# EAGLE schematic Controller Board (EAGLE 8.2.1)
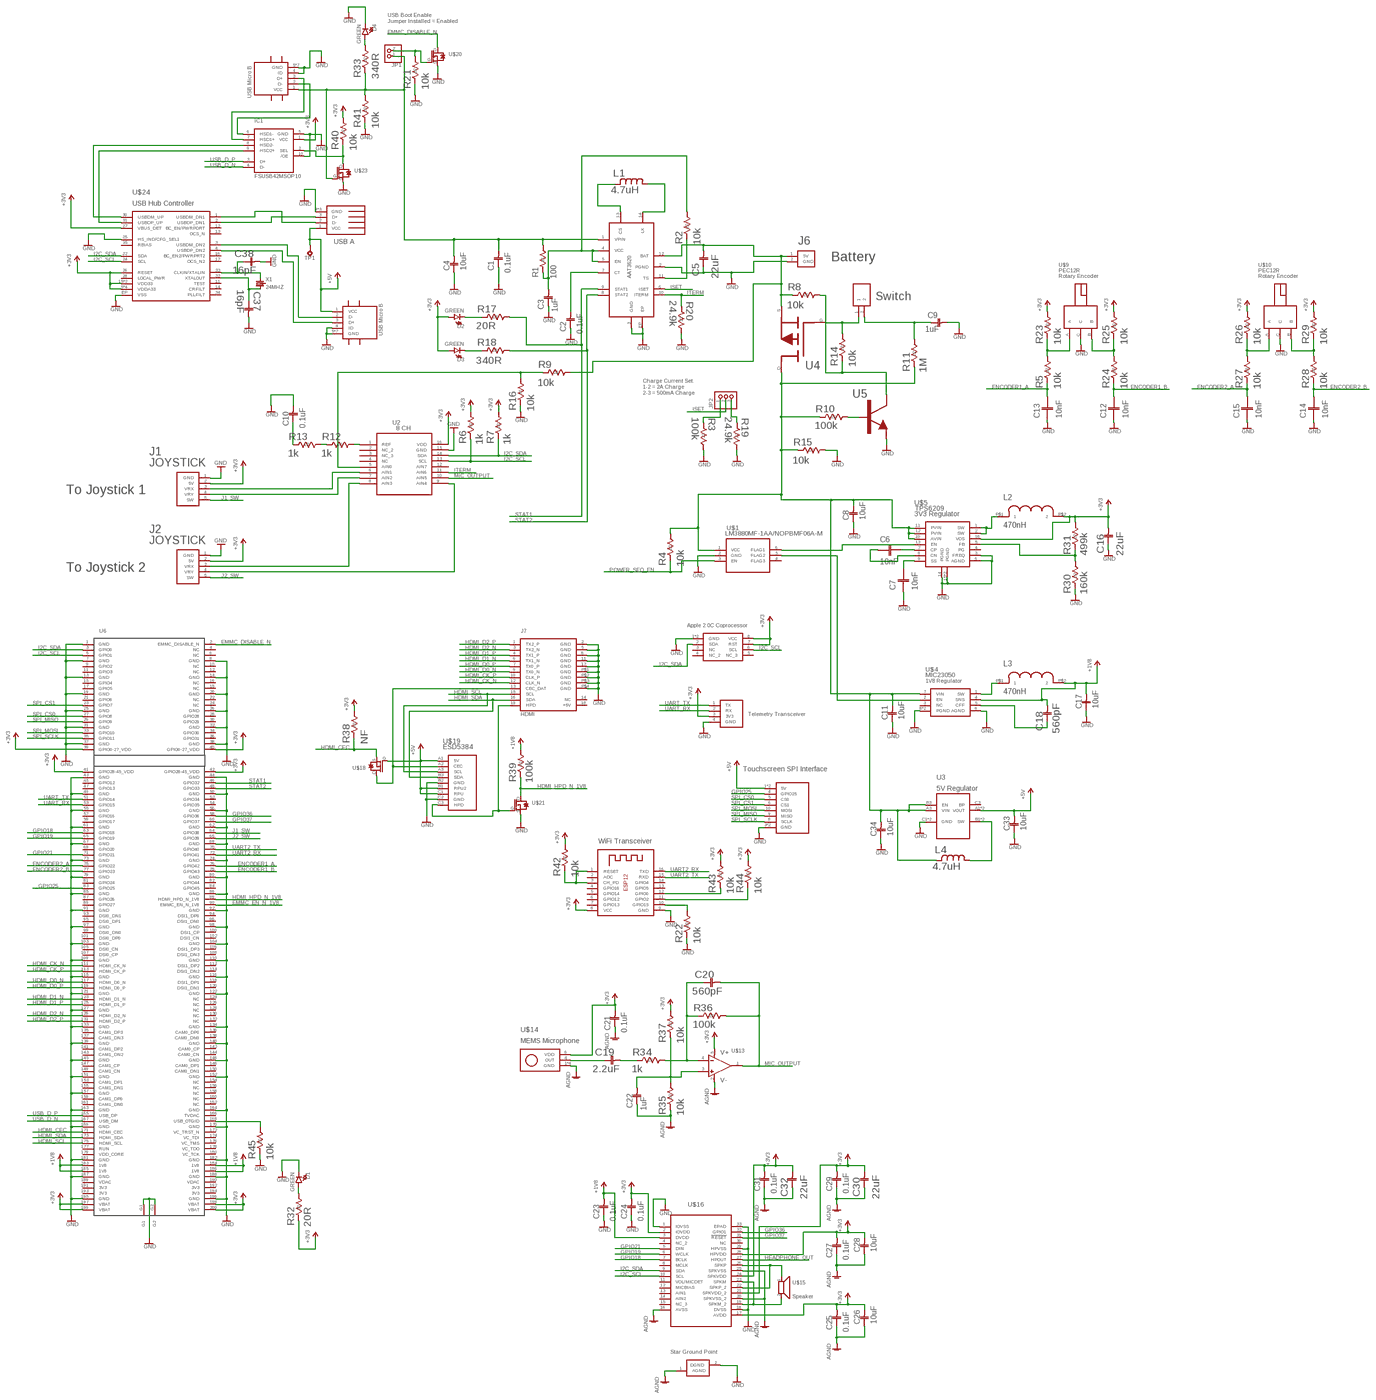
[diagram p0: schematic, sheet 1, overview]
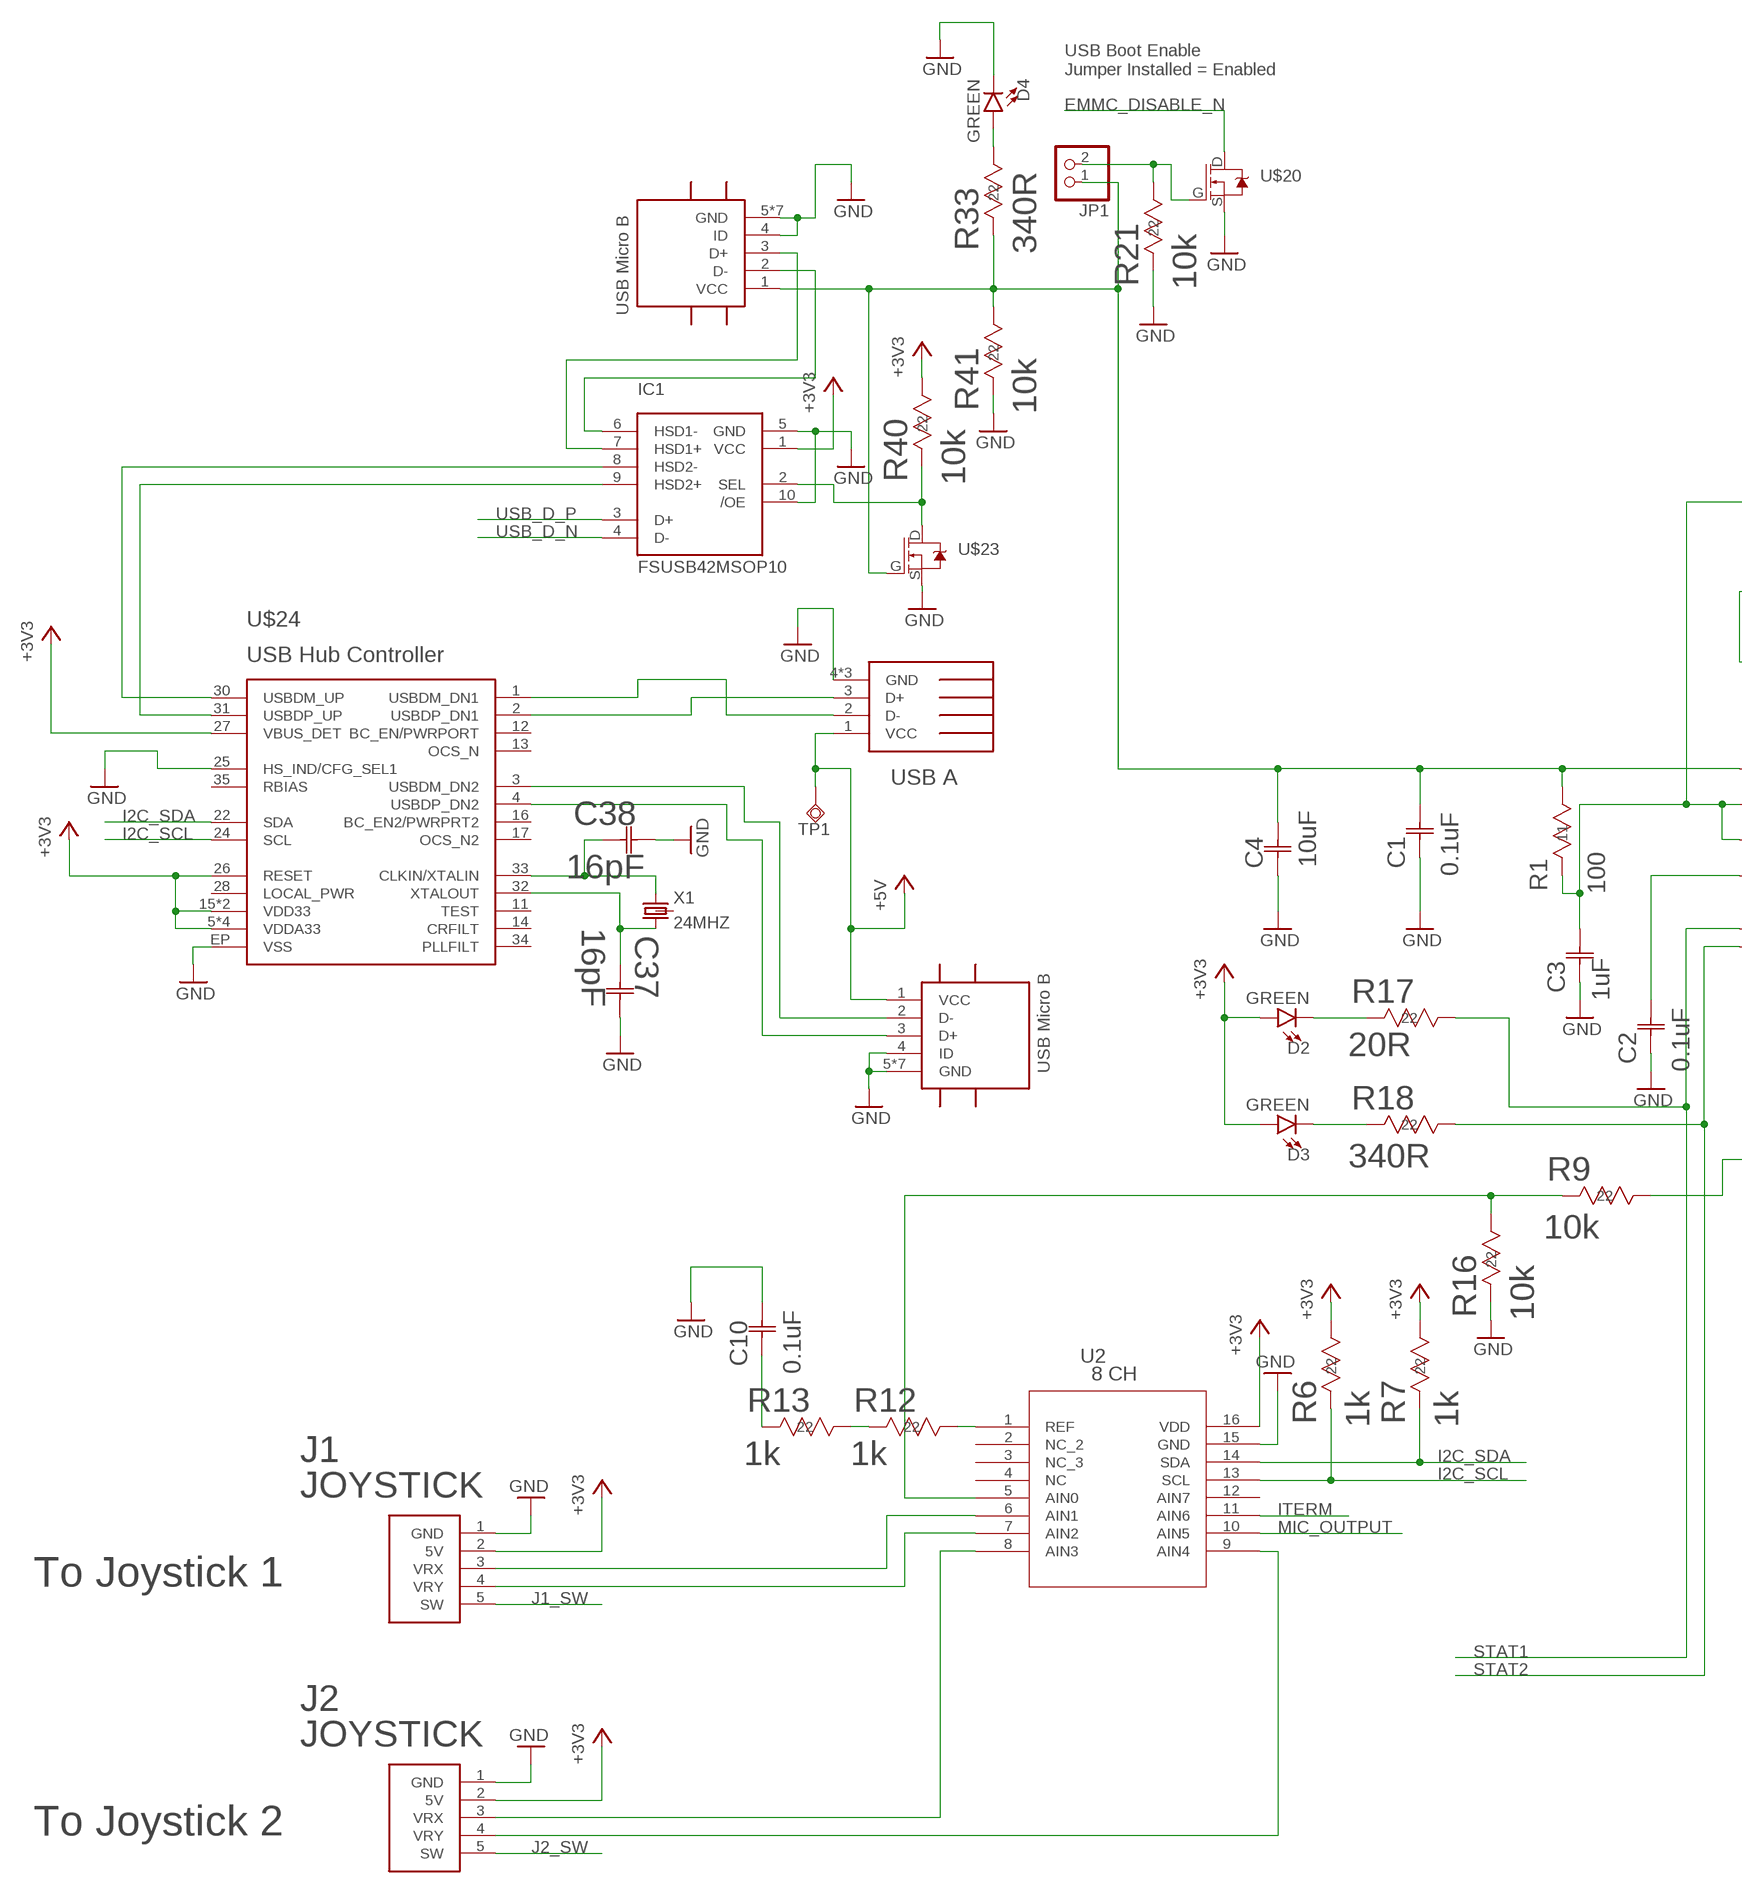
[diagram p1: schematic, sheet 1, part 1 of 4]
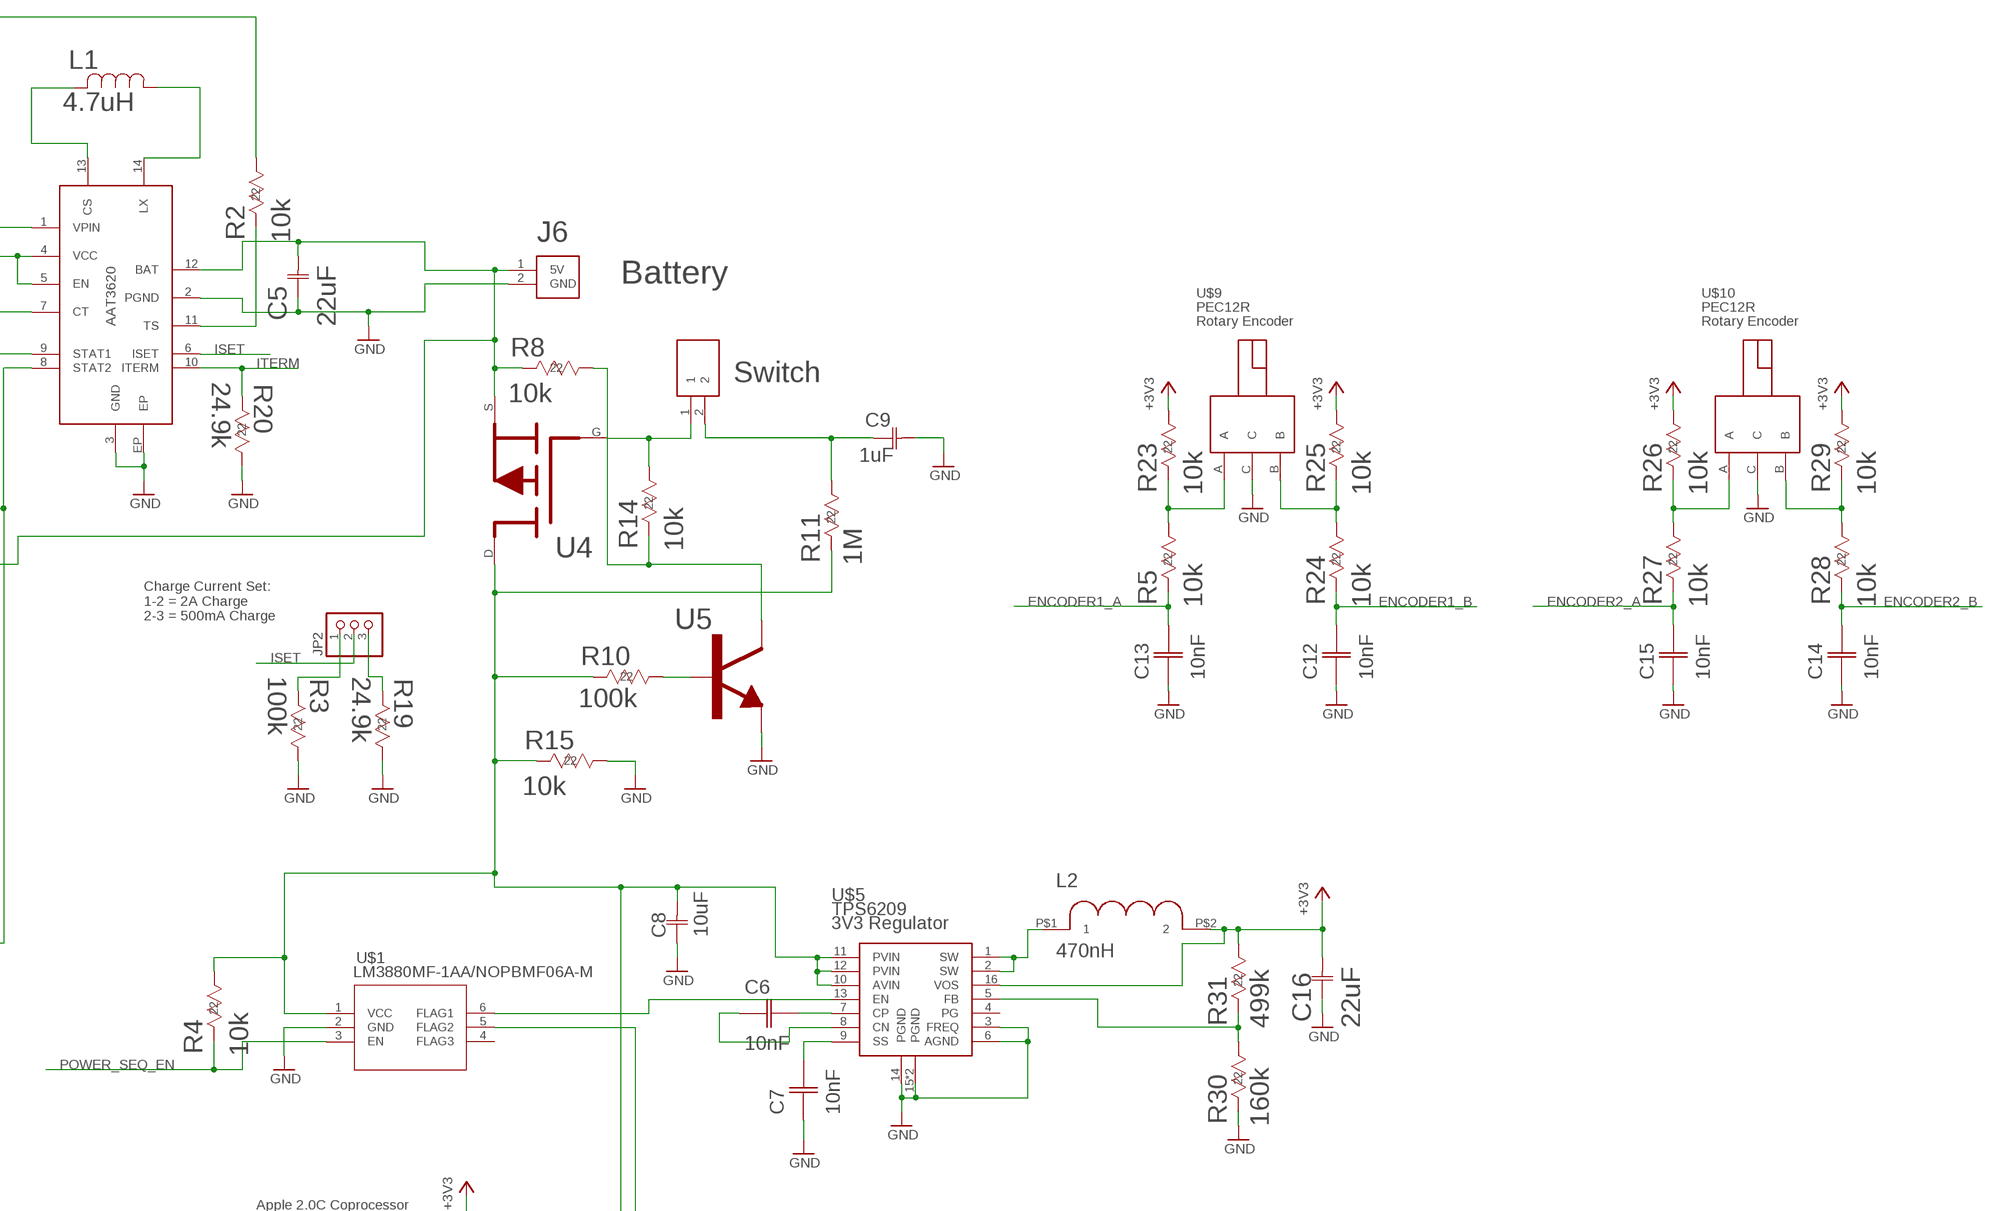
[diagram p2: schematic, sheet 1, part 2 of 4]
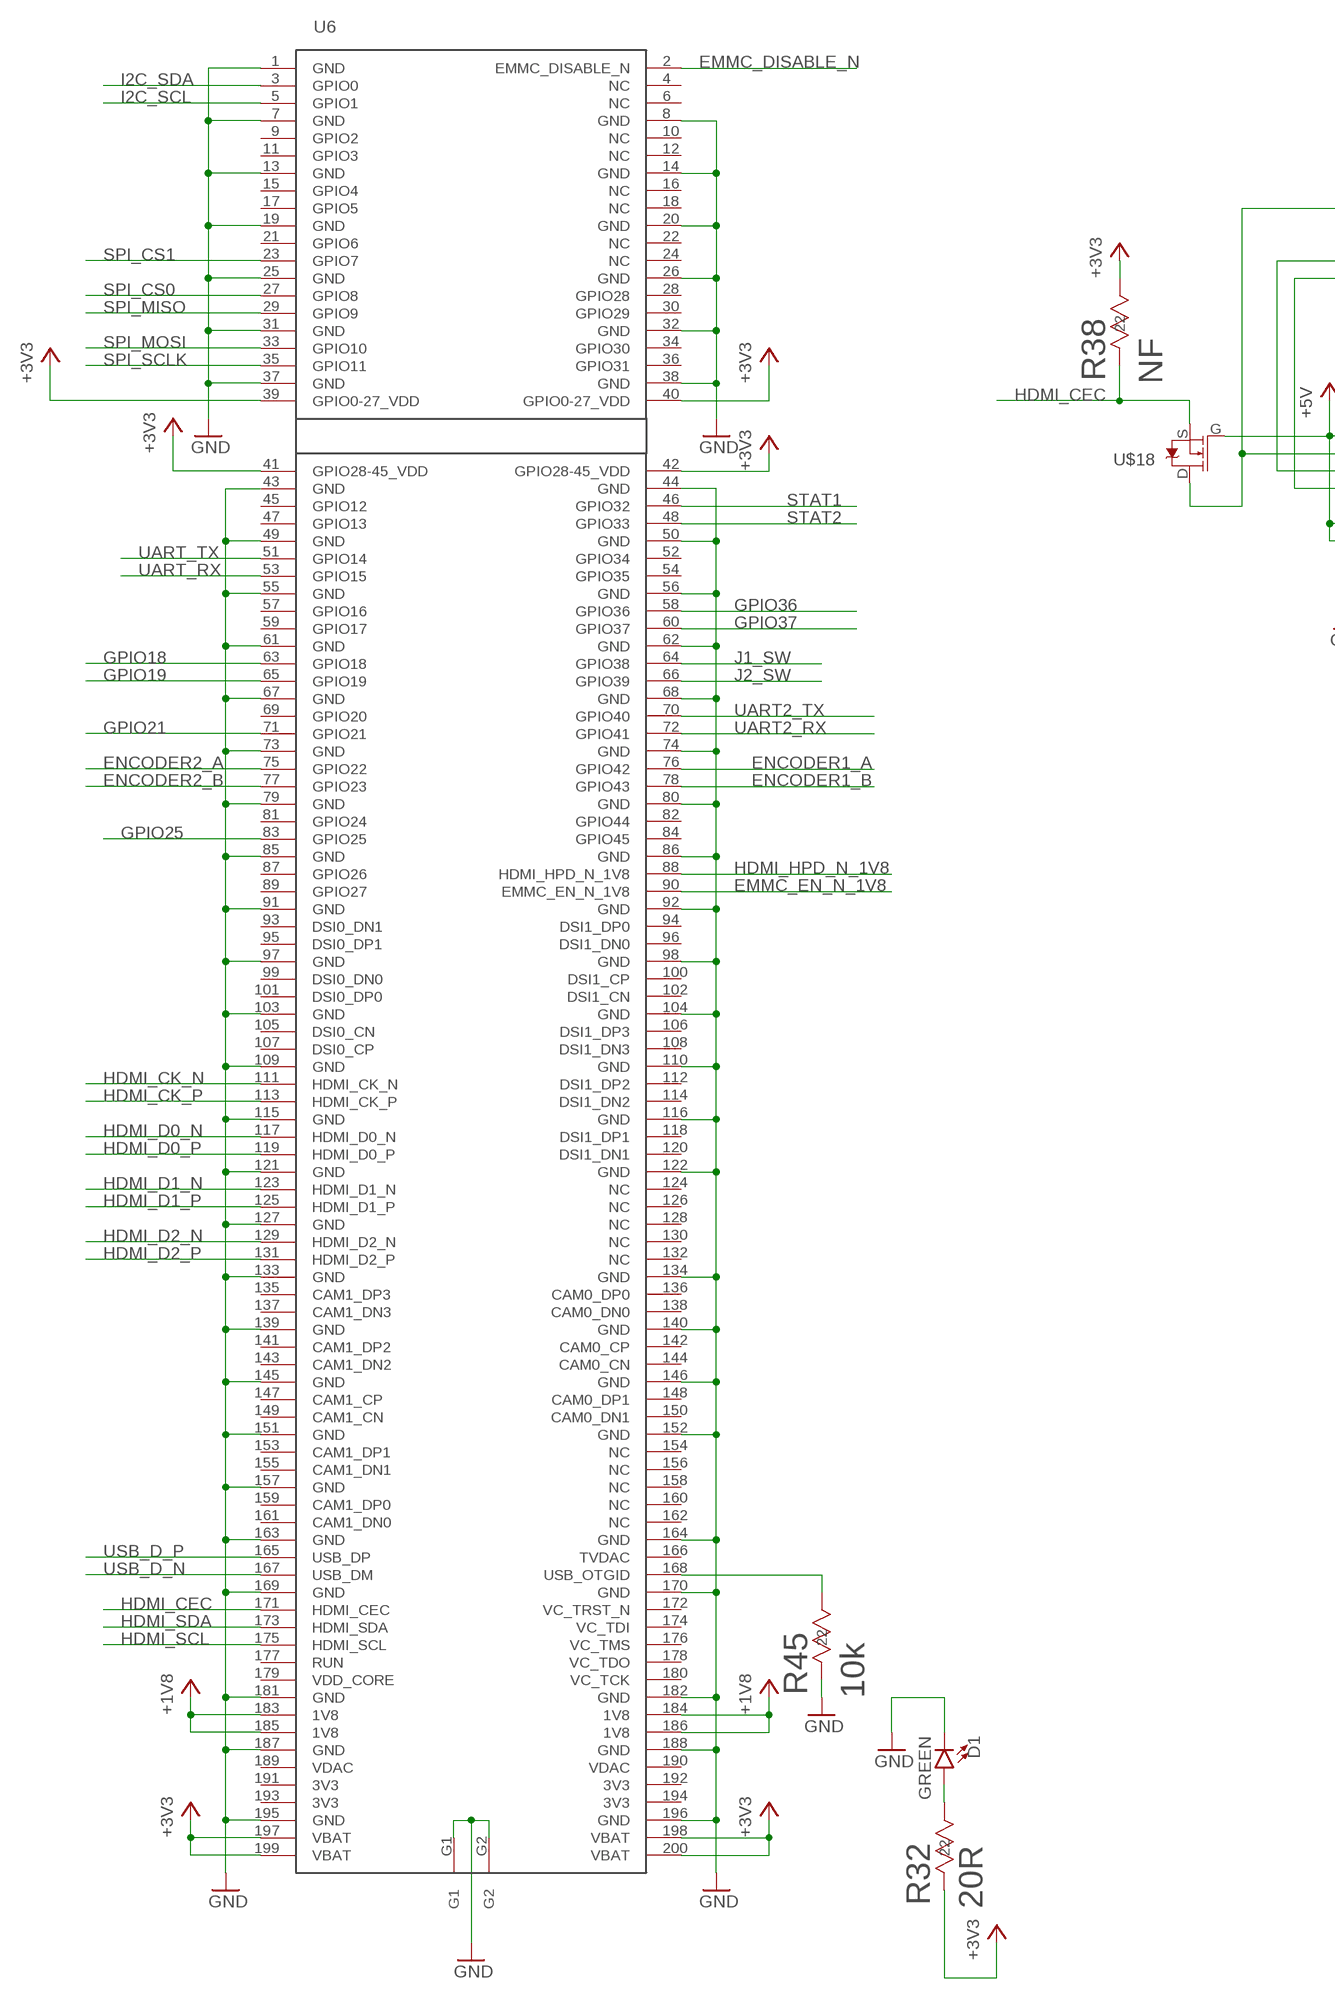
[diagram p3: schematic, sheet 1, part 3 of 4]
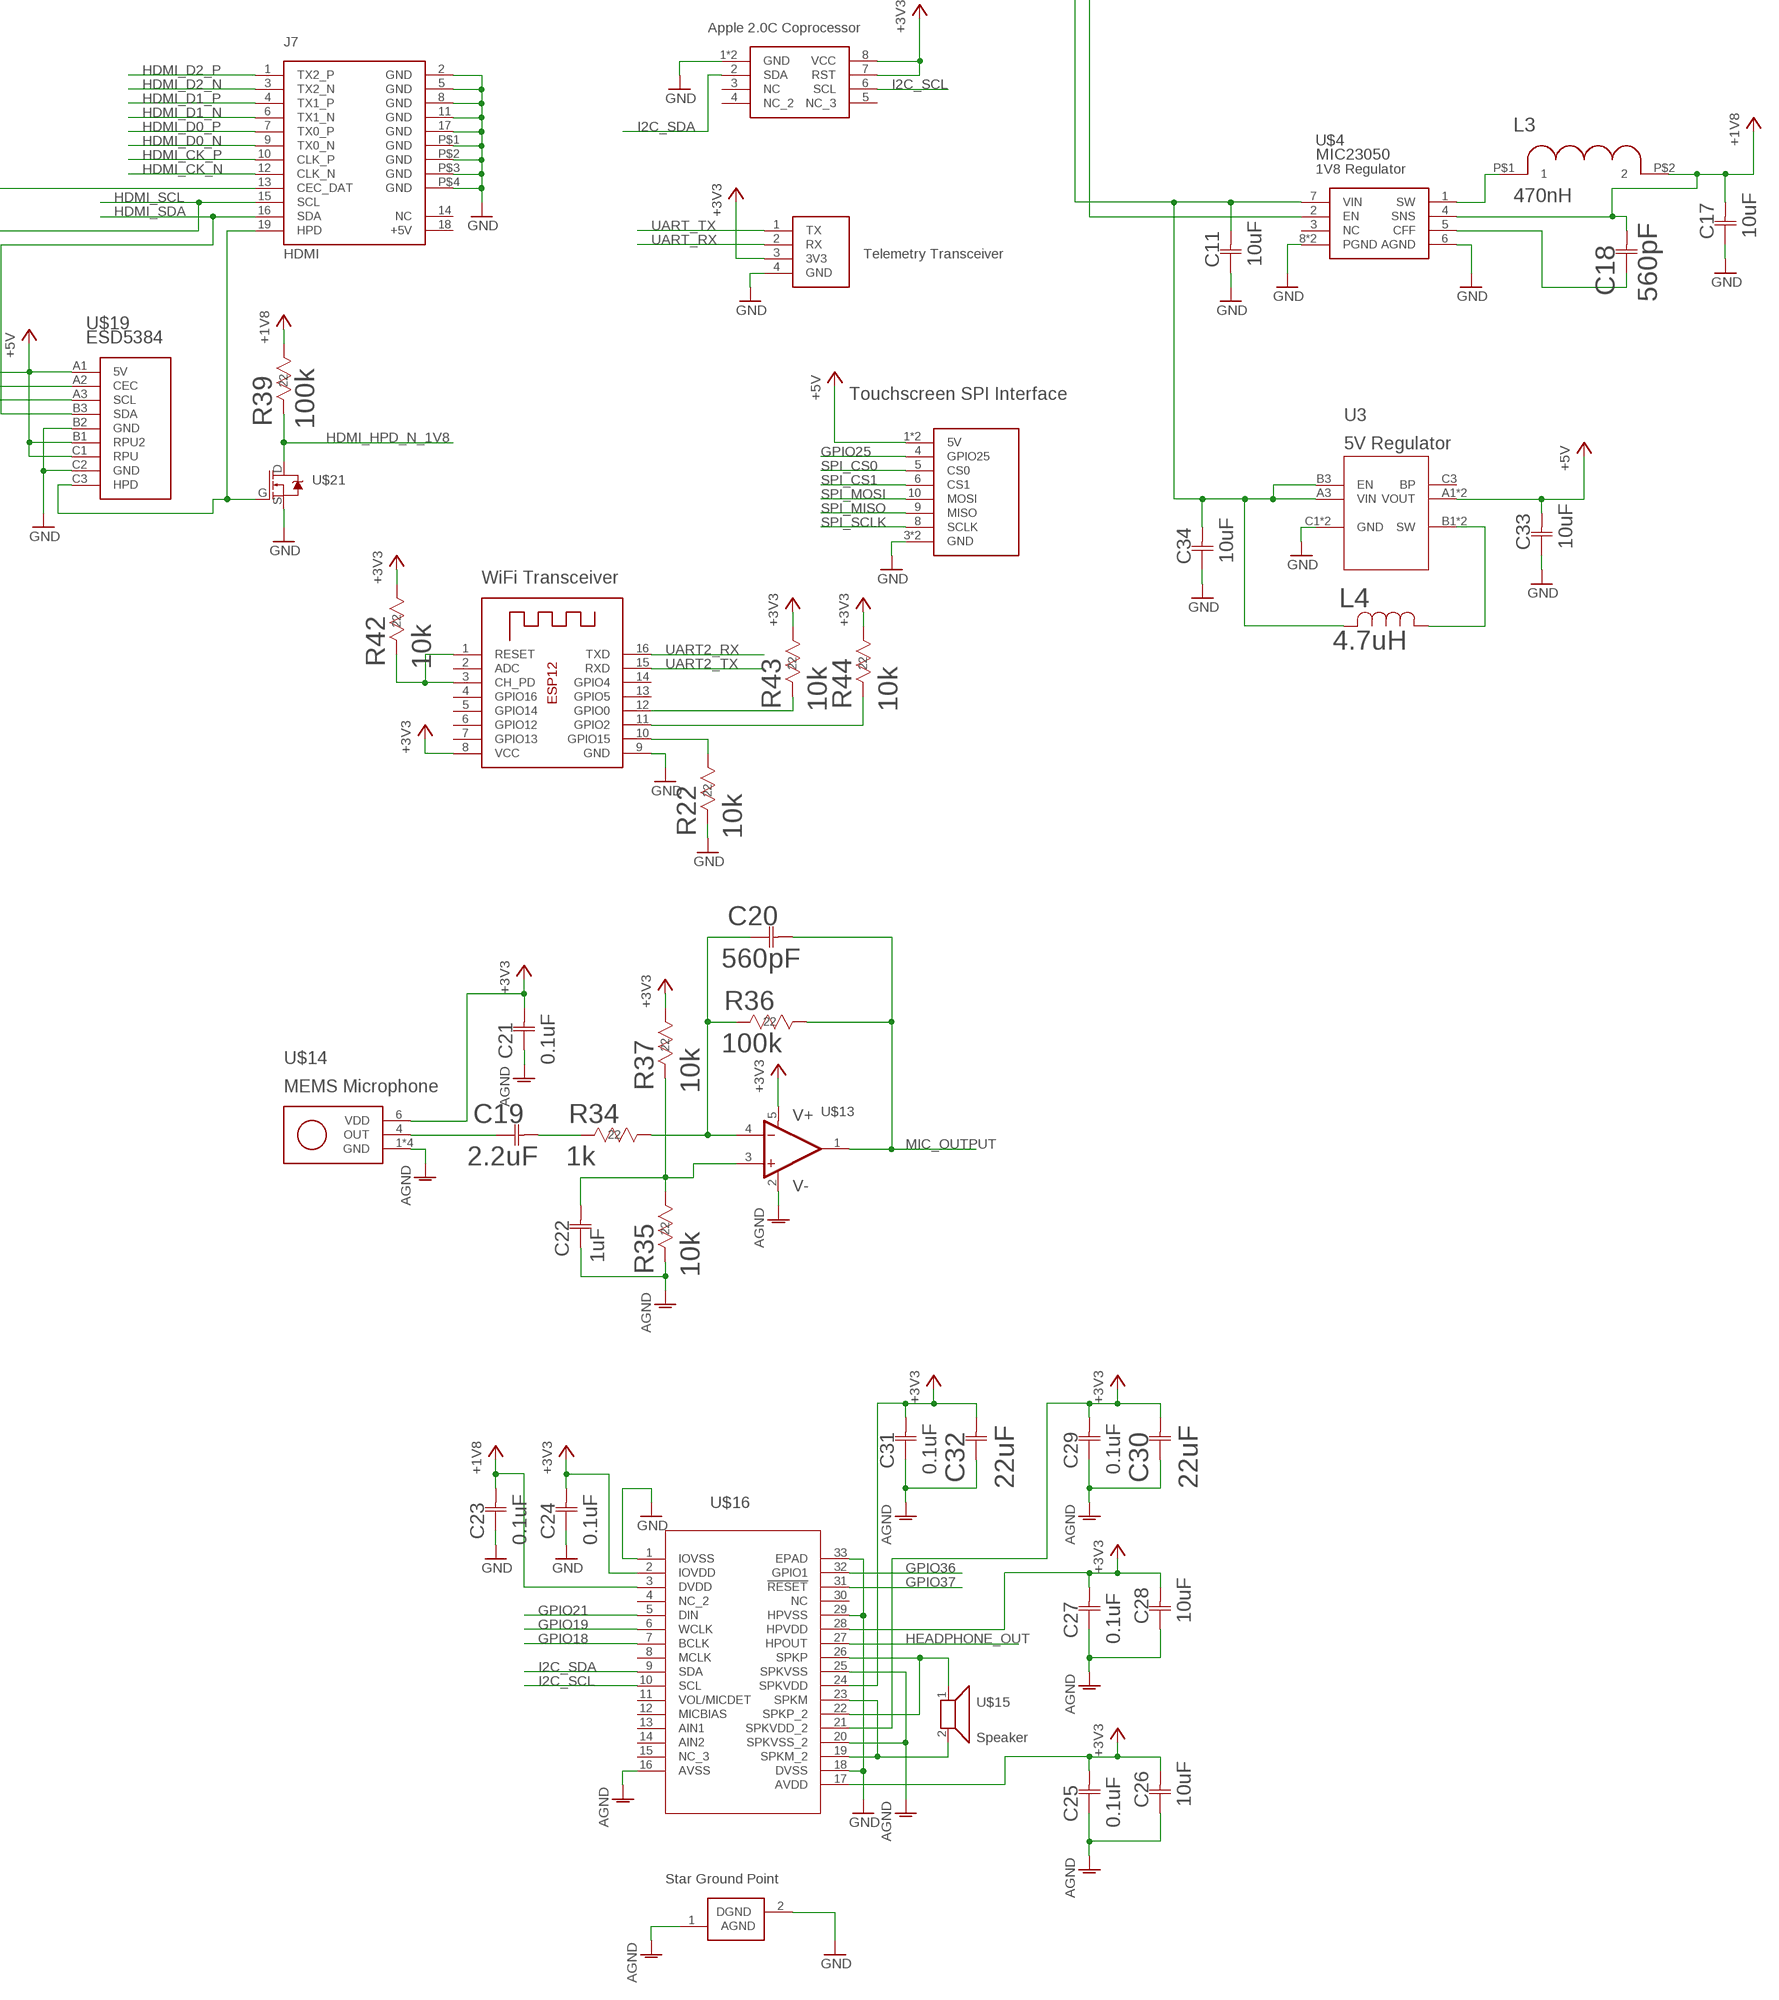
[diagram p4: schematic, sheet 1, part 4 of 4]

## Parts
C1  0.1uF  08055C104KAT2A  [0805]
C2  0.1uF  08055C104KAT2A  [0805]
C3  1uF  CC0805KKX7R7BB105  [YAG_CC0805]
C4  10uF  GRM21BR60J106ME19L  [G-21]
C5  22uF  GRM21BR60J226ME39L  [G-21]
C6  10nF  10NF_CAPACITOR  [0603_CAPACITOR]
C7  10nF  10NF_CAPACITOR  [0603_CAPACITOR]
C8  10uF  GRM21BR60J106ME19L  [G-21]
C9  1uF  CC0805KKX7R7BB105  [YAG_CC0805]
C10  0.1uF  08055C104KAT2A  [0805]
C11  10uF  GRM21BR60J106ME19L  [G-21]
C12  10nF  10NF_CAPACITOR  [0603_CAPACITOR]
C13  10nF  10NF_CAPACITOR  [0603_CAPACITOR]
C14  10nF  10NF_CAPACITOR  [0603_CAPACITOR]
C15  10nF  10NF_CAPACITOR  [0603_CAPACITOR]
C16  22uF  GRM21BR60J226ME39L  [G-21]
C17  10uF  GRM21BR60J106ME19L  [G-21]
C18  560pF  CC0402KRX7R9BB561CC0402N-M  [CC0402N-M]
C19  2.2uF  GRM188R61C225KE15JG-188-M  [G-188-M]
C20  560pF  CC0402KRX7R9BB561CC0402N-M  [CC0402N-M]
C21  0.1uF  08055C104KAT2A  [0805]
C22  1uF  CC0805KKX7R7BB105  [YAG_CC0805]
C23  0.1uF  08055C104KAT2A  [0805]
C24  0.1uF  08055C104KAT2A  [0805]
C25  0.1uF  08055C104KAT2A  [0805]
C26  10uF  GRM21BR60J106ME19L  [G-21]
C27  0.1uF  08055C104KAT2A  [0805]
C28  10uF  GRM21BR60J106ME19L  [G-21]
C29  0.1uF  08055C104KAT2A  [0805]
C30  22uF  GRM21BR60J226ME39L  [G-21]
C31  0.1uF  08055C104KAT2A  [0805]
C32  22uF  GRM21BR60J226ME39L  [G-21]
C33  10uF  GRM21BR60J106ME19L  [G-21]
C34  10uF  GRM21BR60J106ME19L  [G-21]
C37  16pF  GRM1555C1H160JA01DG-155-M  [G-155-M]
C38  16pF  GRM1555C1H160JA01DG-155-M  [G-155-M]
D1  GREEN  LED-GREEN0603  [LED-0603]
D2  GREEN  LED-GREEN0603  [LED-0603]
D3  GREEN  LED-GREEN0603  [LED-0603]
D4  GREEN  LED-GREEN0603  [LED-0603]
IC1  FSUSB42MSOP10  [MSOP10]
J1  JOYSTICK  [JST-XH_5POS]
J2  JOYSTICK  [JST-XH_5POS]
J3  USB_MICRO_B_SMT  [USB_MICRO_B_SMT]
J4  2_PIN_CONNECTOR  [XH_CONNECTOR]
J5  USB_MICRO_B_SMT  [USB_MICRO_B_SMT]
J6  POWER_CONNECTOR  [XH_CONNECTOR]
J7  HDMI  [HDMI]
JP1  PINHD-1X2  [1X02]
JP2  PINHD-1X3  [1X03]
L1  4.7uH  IFSC1515AHER4R7M01IND_IFSC_1515AH-M  [IND_IFSC_1515AH-M]
L2  470nH  470NH_INDUCTOR  [470NH_INDUCTOR]
L3  470nH  470NH_INDUCTOR  [470NH_INDUCTOR]
L4  4.7uH  IFSC1515AHER4R7M01IND_IFSC_1515AH-M  [IND_IFSC_1515AH-M]
R1  100  100_RESISTOR  [1206]
R2  10k  ERA-6AEB103V  [RC0805N]
R3  100k  RC0603JR-07100KLRC0603N-M  [RC0603N-M]
R4  10k  ERA-6AEB103V  [RC0805N]
R5  10k  ERA-6AEB103V  [RC0805N]
R6  1k  RC0603JR-071KLRC0603N-M  [RC0603N-M]
R7  1k  RC0603JR-071KLRC0603N-M  [RC0603N-M]
R8  10k  ERA-6AEB103V  [RC0805N]
R9  10k  ERA-6AEB103V  [RC0805N]
R10  100k  RC0603JR-07100KLRC0603N-M  [RC0603N-M]
R11  1M  RC0603JR-071MLRC0603N-M  [RC0603N-M]
R12  1k  RC0603JR-071KLRC0603N-M  [RC0603N-M]
R13  1k  RC0603JR-071KLRC0603N-M  [RC0603N-M]
R14  10k  ERA-6AEB103V  [RC0805N]
R15  10k  ERA-6AEB103V  [RC0805N]
R16  10k  ERA-6AEB103V  [RC0805N]
R17  20R  RC0603JR-0720RLRC0603N-M  [RC0603N-M]
R18  340R  RC0603FR-07340RL  [RC0603N]
R19  24.9k  RC0402FR-0724K9LRC0402N-M  [RC0402N-M]
R20  24.9k  RC0402FR-0724K9LRC0402N-M  [RC0402N-M]
R21  10k  ERA-6AEB103V  [RC0805N]
R22  10k  ERA-6AEB103V  [RC0805N]
R23  10k  ERA-6AEB103V  [RC0805N]
R24  10k  ERA-6AEB103V  [RC0805N]
R25  10k  ERA-6AEB103V  [RC0805N]
R26  10k  ERA-6AEB103V  [RC0805N]
R27  10k  ERA-6AEB103V  [RC0805N]
R28  10k  ERA-6AEB103V  [RC0805N]
R29  10k  ERA-6AEB103V  [RC0805N]
R30  160k  RC0603FR-07160KLRC0603N-M  [RC0603N-M]
R31  499k  RC0603FR-07499KLRC0603N-M  [RC0603N-M]
R32  20R  RC0603JR-0720RLRC0603N-M  [RC0603N-M]
R33  340R  RC0603FR-07340RL  [RC0603N]
R34  1k  RC0603JR-071KLRC0603N-M  [RC0603N-M]
R35  10k  ERA-6AEB103V  [RC0805N]
R36  100k  RC0603JR-07100KLRC0603N-M  [RC0603N-M]
R37  10k  ERA-6AEB103V  [RC0805N]
R38  NF  ERA-6AEB103V  [RC0805N]
R39  100k  RC0603JR-07100KLRC0603N-M  [RC0603N-M]
R40  10k  ERA-6AEB103V  [RC0805N]
R41  10k  ERA-6AEB103V  [RC0805N]
R42  10k  ERA-6AEB103V  [RC0805N]
R43  10k  ERA-6AEB103V  [RC0805N]
R44  10k  ERA-6AEB103V  [RC0805N]
R45  10k  ERA-6AEB103V  [RC0805N]
TP1  TPSQTP20R  [TP20R]
U1  AAT3620_BATT_CHARGER  [AAT3620_TDFN]
U2  8 CH  MAX11608EEE+21-0055H_16-M  [21-0055H_16-M]
U3  TPS61256YFFR  [YFF9]
U4  DMP3030SN_MOSFET  [SC59_MOSFET]
U5  NPN_BCW65CLT1G  [SOT-23_(TO-236AB)]
U6  COMPUTE_MODULE  [SO-DIMM]
U$1  LM3880MF-1AA/NOPBMF06A-M  [MF06A-M]
U$2  APPLE_2.0C_COPROCESSOR  [PG-USON-8-1]
U$3  4_PIN_TELE_CONNECTOR  [4_PIN_TELE_CONNECTOR]
U$4  MIC23050  [MLF(ML)_8PIN]
U$5  TPS6209  [VQFN16]
U$9  PEC12R  [PEC12R]
U$10  PEC12R  [PEC12R]
U$11  USB_A_RECEPT  [USB_A_RECEPT]
U$12  3.5_TOUCHSCREEN  [3.5_TOUCHSCREEN]
U$13  MCP6001T-I/OTSOT-23-5_MC-M  [SOT-23-5_MC-M]
U$14  SPH1642HT5H-1  [SISONIC_MICROPHONE]
U$15  SP-1510  [SPEAKER]
U$16  TLV320DAC3120IRHBR  [RHB32_3P45X3P45]
U$18  DMG1012T  [SOT-523]
U$19  ESD5384  [WLCSP9]
U$20  DMG1012T  [SOT-523]
U$21  DMG1012T  [SOT-523]
U$23  DMG1012T  [SOT-523]
U$24  USB2512B  [36-SQFN]
U$25  AGND-DGND  [AGND-DGND]
X1  24MHZ  FA-128-24MHZ  [FA-128]
X2  ESP-12  [ESP-12]

## Nets
+3V3: C16.2 C17.2 C18.2 C21.2 C23.2 C24.2 C25.2 C26.2 C27.2 C28.2 C29.2 C30.2 C31.2 C32.2 D2.A D3.A IC1.1(VCC) J1.2(5V) J2.2(5V) L2.P$2 L3.P$2 R6.1 R7.1 R23.1 R25.1 R26.1 R29.1 R31.1 R32.2 R37.1 R38.1 R39.1 R40.1 R42.1 R43.1 R44.1 U2.16(VDD) U6.39(GPIO0-27_VDD) U6.40(GPIO0-27_VDD) U6.41(GPIO28-45_VDD) U6.42(GPIO28-45_VDD) U6.183(1V8) U6.184(1V8) U6.185(1V8) U6.186(1V8) U6.197(VBAT) U6.198(VBAT) U6.199(VBAT) U6.200(VBAT) U$2.7(RST) U$2.8(VCC) U$3.3(3V3) U$4.4(SNS) U$5.16(VOS) U$13.5(VDD) U$14.6(VDD) U$16.2(IOVDD) U$16.3(DVDD) U$16.17(AVDD) U$16.21(SPKVDD_2) U$16.24(SPKVDD) U$16.28(HPVDD) U$24.5(VDDA33) U$24.10(VDDA33) U$24.15(VDD33) U$24.23(VDD33) U$24.26(RESET) U$24.27(VBUS_DET) U$24.29(VDDA33) U$24.36(VDDA33) X2.8(VCC) ; supply symbol labelled +1V8
+5V: C33.2 J5.1(VCC) TP1.TP U3.A1(VOUT) U3.A2(VOUT) U$11.1(VCC) U$12.1(5V) U$12.2(5V) U$18.G U$19.A1(5V) U$19.B1(RPU2) U$19.C1(RPU)
AGND: C21.1 C22.1 C25.1 C26.1 C27.1 C28.1 C29.1 C30.1 C31.1 C32.1 R35.2 U$13.2(VSS) U$14.1(GND) U$14.2(GND) U$14.3(GND) U$14.5(GND) U$16.16(AVSS) U$16.20(SPKVSS_2) U$16.25(SPKVSS) U$25.1(AGND)
D1_N: IC1.6(HSD1-) J3.2(D-)
D1_P: IC1.7(HSD1+) J3.3(D+)
D2_N: IC1.8(HSD2-) U$24.30(USBDM_UP)
D2_P: IC1.9(HSD2+) U$24.31(USBDP_UP)
DS1_N: U$11.2(D-) U$24.1(USBDM_DN1)
DS1_P: U$11.3(D+) U$24.2(USBDP_DN1)
DS2_N: J5.2(D-) U$24.3(USBDM_DN2)
DS2_P: J5.3(D+) U$24.4(USBDP_DN2)
EMMC_DISABLE_N: U6.2(EMMC_DISABLE_N) U$20.D
EMMC_EN_N_1V8: U6.90(EMMC_EN_N_1V8)
ENCODER1_A: C13.2 R5.2 U6.76(GPIO42)
ENCODER1_B: C12.2 R24.2 U6.78(GPIO43)
ENCODER2_A: C15.2 R27.2 U6.75(GPIO22)
ENCODER2_B: C14.2 R28.2 U6.77(GPIO23)
GND: C1.1 C2.1 C3.1 C4.1 C5.1 C7.1 C8.1 C9.2 C10.2 C11.1 C12.1 C13.1 C14.1 C15.1 C16.1 C17.1 C23.1 C24.1 C33.1 C34.1 C37.2 C38.2 D1.C D4.C IC1.5(GND) IC1.10(/OE) J1.1(GND) J2.1(GND) J3.4(ID) J3.5(GND) J3.6(GND) J3.7(GND) J3.P$1(GND) J3.P$2(GND) J3.P$3(GND) J3.P$4(GND) J5.4(ID) J5.5(GND) J5.6(GND) J5.7(GND) J5.P$1(GND) J5.P$2(GND) J5.P$3(GND) J5.P$4(GND) J6.2(GND) J7.2(GND) J7.5(GND) J7.8(GND) J7.11(GND) J7.17(GND) J7.P$1(GND) J7.P$2(GND) J7.P$3(GND) J7.P$4(GND) R3.1 R15.1 R16.2 R19.1 R20.1 R21.2 R22.2 R30.2 R41.2 R45.2 U1.2(PGND) U1.3(GND) U1.EP U2.15(GND) U3.C1(GND) U3.C2(GND) U5.S(E) U6.1(GND) U6.7(GND) U6.8(GND) U6.13(GND) U6.14(GND) U6.19(GND) U6.20(GND) U6.25(GND) U6.26(GND) U6.31(GND) U6.32(GND) U6.37(GND) U6.38(GND) U6.43(GND) U6.44(GND) U6.49(GND) U6.50(GND) U6.55(GND) U6.56(GND) U6.61(GND) U6.62(GND) U6.67(GND) U6.68(GND) U6.73(GND) U6.74(GND) U6.79(GND) U6.80(GND) U6.85(GND) U6.86(GND) U6.91(GND) U6.92(GND) U6.97(GND) U6.98(GND) U6.103(GND) U6.104(GND) U6.109(GND) U6.110(GND) U6.115(GND) U6.116(GND) U6.121(GND) U6.122(GND) U6.127(GND) U6.133(GND) U6.134(GND) U6.139(GND) U6.140(GND) U6.145(GND) U6.146(GND) U6.151(GND) U6.152(GND) U6.157(GND) U6.163(GND) U6.164(GND) U6.169(GND) U6.170(GND) U6.181(GND) U6.182(GND) U6.187(GND) U6.188(GND) U6.195(GND) U6.196(GND) U6.G1 U6.G2 U$1.2(GND) U$2.1(GND) U$2.9(GND) U$3.4(GND) U$4.6(AGND) U$4.8(PGND) U$4.EP(PGND) U$5.3(FREQ) U$5.6(AGND) U$5.14(PGND) U$5.15(PGND) U$5.17(PGND) U$9.C U$10.C U$11.4(GND) U$11.5(GND) U$11.6(GND) U$12.3(GND) U$12.7(GND) U$16.1(IOVSS) U$16.18(DVSS) U$16.29(HPVSS) U$16.33(EPAD) U$19.B2(GND) U$19.C2(GND) U$20.S U$21.S U$23.S U$24.25(HS_IND/CFG_SEL1) U$24.EP(VSS) U$25.2(DGND) X2.9(GND)
GPIO18: U6.63(GPIO18) U$16.7(BCLK)
GPIO19: U6.65(GPIO19) U$16.6(WCLK)
GPIO21: U6.71(GPIO21) U$16.5(DIN)
GPIO25: U6.83(GPIO25) U$12.4(GPIO25)
GPIO36: U6.58(GPIO36) U$16.32(GPIO1)
GPIO37: U6.60(GPIO37) U$16.31(!RESET)
HDMI_CEC: R38.2 U6.171(HDMI_CEC) U$18.S
HDMI_CK_N: J7.12(CLK_N) U6.111(HDMI_CK_N)
HDMI_CK_P: J7.10(CLK_P) U6.113(HDMI_CK_P)
HDMI_D0_N: J7.9(TX0_N) U6.117(HDMI_D0_N)
HDMI_D0_P: J7.7(TX0_P) U6.119(HDMI_D0_P)
HDMI_D1_N: J7.6(TX1_N) U6.123(HDMI_D1_N)
HDMI_D1_P: J7.4(TX1_P) U6.125(HDMI_D1_P)
HDMI_D2_N: J7.3(TX2_N) U6.129(HDMI_D2_N)
HDMI_D2_P: J7.1(TX2_P) U6.131(HDMI_D2_P)
HDMI_HPD_N_1V8: R39.2 U6.88(HDMI_HPD_N_1V8) U$21.D
HDMI_SCL: J7.15(SCL) U6.175(HDMI_SCL) U$19.A3(SCL)
HDMI_SDA: J7.16(SDA) U6.173(HDMI_SDA) U$19.B3(SDA)
HEADPHONE_OUT: U$16.27(HPOUT)
I2C_SCL: R6.2 U2.13(SCL) U6.5(GPIO1) U$2.6(SCL) U$16.10(SCL) U$24.24(SCL)
I2C_SDA: R7.2 U2.14(SDA) U6.3(GPIO0) U$2.2(SDA) U$16.9(SDA) U$24.22(SDA)
ISET: JP2.2 U1.6(ISET)
ITERM: R20.2 U1.10(ITERM) U2.11(AIN6)
J1_SW: J1.5(SW) U6.64(GPIO38)
J2_SW: J2.5(SW) U6.66(GPIO39)
MIC_OUTPUT: C20.2 R36.1 U2.10(AIN5) U$13.1(VOUT)
N$1: J4.1 R14.1 U4.G
N$2: C2.2 U1.7(CT)
N$3: JP1.2 R21.1 U$20.G
N$4: L1.2 U1.13(CS)
N$5: L1.1 U1.14(LX)
N$6: C3.2 R1.1 R2.1 U1.4(VCC) U1.5(EN)
N$7: C5.2 J6.1(5V) R8.2 R9.1 U1.12(BAT) U4.S
N$8: U$1.6(FLAG1) U$5.13(EN)
N$9: D4.A R33.1
N$10: D1.A R32.1
N$11: R2.2 U1.11(TS)
N$12: U$1.5(FLAG2) U$4.2(EN)
N$13: C6.2 U$5.7(CP)
N$14: C19.1 U$14.4(OUT)
N$15: D2.C R17.2
N$16: R12.1 U2.1(REF)
N$17: J1.3(VRX) U2.6(AIN1)
N$18: J1.4(VRY) U2.7(AIN2)
N$19: J2.3(VRX) U2.8(AIN3)
N$20: J2.4(VRY) U2.9(AIN4)
N$21: C19.2 R34.2
N$22: D3.C R18.2
N$23: C6.1 U$5.8(CN)
N$24: R12.2 R13.1
N$25: R10.1 U5.G(B)
N$26: C9.1 J4.2 R11.1
N$27: R8.1 R14.2 U5.D(C)
N$28: C10.1 R13.2
N$29: C7.2 U$5.9(SS)
N$30: L2.P$1 U$5.1(SW) U$5.2(SW)
N$31: R5.1 R23.2 U$9.A
N$32: L3.P$1 U$4.1(SW)
N$33: R42.2 X2.1(RESET) X2.3(CH_PD)
N$34: R24.1 R25.2 U$9.B
N$35: C20.1 R34.1 R36.2 U$13.4(VIN-)
N$36: C22.2 R35.1 R37.2 U$13.3(VIN+)
N$37: R26.2 R27.1 U$10.A
N$38: R28.1 R29.2 U$10.B
N$39: R9.2 R16.1 U2.5(AIN0)
N$40: JP2.1 R3.2
N$41: U$15.1 U$16.22(SPKP_2) U$16.26(SPKP)
N$42: JP2.3 R19.2
N$43: R22.1 X2.10(GPIO15)
N$44: U$15.2 U$16.19(SPKM_2) U$16.23(SPKM)
N$45: R43.2 X2.12(GPIO0)
N$46: R30.1 R31.2 U$5.5(FB)
N$47: C8.2 C11.2 C34.2 L4.2 R4.1 R10.2 R11.2 R15.2 U3.A3(VIN) U3.B3(EN) U4.D U$1.1(VCC) U$4.7(VIN) U$5.10(AVIN) U$5.11(PVIN) U$5.12(PVIN)
N$48: C18.1 U$4.5(CFF)
N$49: J7.13(CEC_DAT) U$18.D U$19.A2(CEC)
N$50: J7.19(HPD) U$19.C3(HPD) U$21.G
N$51: R44.2 X2.11(GPIO2)
N$52: C38.1 U$24.33(CLKIN/XTALIN) X1.1
N$53: R45.1 U6.168(USB_OTGID)
N$59: IC1.2(SEL) R40.2 U$23.D
N$60: C37.1 U$24.32(XTALOUT) X1.3
N$61: L4.1 U3.B1(SW) U3.B2(SW)
POWER_SEQ_EN: R4.2 U$1.3(EN)
SPI_CS0: U6.27(GPIO8) U$12.5(CS0)
SPI_CS1: U6.23(GPIO7) U$12.6(CS1)
SPI_MISO: U6.29(GPIO9) U$12.9(MISO)
SPI_MOSI: U6.33(GPIO10) U$12.10(MOSI)
SPI_SCLK: U6.35(GPIO11) U$12.8(SCLK)
STAT1: R17.1 U1.9(STAT1) U6.46(GPIO32)
STAT2: R18.1 U1.8(STAT2) U6.48(GPIO33)
UART2_RX: U6.72(GPIO41) X2.16(TXD)
UART2_TX: U6.70(GPIO40) X2.15(RXD)
UART_RX: U6.53(GPIO15) U$3.2(RX)
UART_TX: U6.51(GPIO14) U$3.1(TX)
USB_5V: C1.2 C4.2 J3.1(VCC) JP1.1 R1.2 R33.2 R41.1 U1.1(VPIN) U$23.G
USB_D_N: IC1.4(D-) U6.167(USB_DM)
USB_D_P: IC1.3(D+) U6.165(USB_DP)
Unconnected: J7.14(NC) J7.18(+5V) U2.2(NC_2) U2.3(NC_3) U2.4(NC) U2.12(AIN7) U3.C3(BP) U6.4(NC) U6.6(NC) U6.9(GPIO2) U6.10(NC) U6.11(GPIO3) U6.12(NC) U6.15(GPIO4) U6.16(NC) U6.17(GPIO5) U6.18(NC) U6.21(GPIO6) U6.22(NC) U6.24(NC) U6.28(GPIO28) U6.30(GPIO29) U6.34(GPIO30) U6.36(GPIO31) U6.45(GPIO12) U6.47(GPIO13) U6.52(GPIO34) U6.54(GPIO35) U6.57(GPIO16) U6.59(GPIO17) U6.69(GPIO20) U6.81(GPIO24) U6.82(GPIO44) U6.84(GPIO45) U6.87(GPIO26) U6.89(GPIO27) U6.93(DSI0_DN1) U6.94(DSI1_DP0) U6.95(DSI0_DP1) U6.96(DSI1_DN0) U6.99(DSI0_DN0) U6.100(DSI1_CP) U6.101(DSI0_DP0) U6.102(DSI1_CN) U6.105(DSI0_CN) U6.106(DSI1_DP3) U6.107(DSI0_CP) U6.108(DSI1_DN3) U6.112(DSI1_DP2) U6.114(DSI1_DN2) U6.118(DSI1_DP1) U6.120(DSI1_DN1) U6.124(NC) U6.126(NC) U6.128(NC) U6.130(NC) U6.132(NC) U6.135(CAM1_DP3) U6.136(CAM0_DP0) U6.137(CAM1_DN3) U6.138(CAM0_DN0) U6.141(CAM1_DP2) U6.142(CAM0_CP) U6.143(CAM1_DN2) U6.144(CAM0_CN) U6.147(CAM1_CP) U6.148(CAM0_DP1) U6.149(CAM1_CN) U6.150(CAM0_DN1) U6.153(CAM1_DP1) U6.154(NC) U6.155(CAM1_DN1) U6.156(NC) U6.158(NC) U6.159(CAM1_DP0) U6.160(NC) U6.161(CAM1_DN0) U6.162(NC) U6.166(TVDAC) U6.172(VC_TRST_N) U6.174(VC_TDI) U6.176(VC_TMS) U6.177(RUN) U6.178(VC_TDO) U6.179(VDD_CORE) U6.180(VC_TCK) U6.189(VDAC) U6.190(VDAC) U6.191(3V3) U6.192(3V3) U6.193(3V3) U6.194(3V3) U$1.4(FLAG3) U$2.3(NC) U$2.4(NC_2) U$2.5(NC_3) U$4.3(NC) U$5.4(PG) U$16.4(NC_2) U$16.8(MCLK) U$16.11(VOL/MICDET) U$16.12(MICBIAS) U$16.13(AIN1) U$16.14(AIN2) U$16.15(NC_3) U$16.30(NC) U$24.11(TEST) U$24.12(BC_EN/PWRPORT) U$24.13(OCS_N) U$24.14(CRFILT) U$24.16(BC_EN2/PWRPRT2) U$24.17(OCS_N2) U$24.28(LOCAL_PWR) U$24.34(PLLFILT) U$24.35(RBIAS) X1.2(GND) X1.4(GND) X2.2(ADC) X2.4(GPIO16) X2.5(GPIO14) X2.6(GPIO12) X2.7(GPIO13) X2.13(GPIO5) X2.14(GPIO4)

## Notes on the sheet
- USB Boot Enable
  Jumper Installed = Enabled
- Battery
- Switch
- Charge Current Set:
  1-2 = 2A Charge
  2-3 = 500mA Charge
- To Joystick 1
- To Joystick 2
- Telemetry Transceiver
- Star Ground Point

## Library data of the parts
C1 C2 C10 C21 C23-C25 C27 C29 C31 = 0.1uF X7R Ceramic Capacitor:08055C104KAT2A; COPYRIGHT: Copyright C 2015 Accelerated Designs. All rights reserved; MANUFACTURER_PART_NUMBER: 08055C104KAT2A; VENDOR: Vendor
C3 C9 C22 = 1uF X7R Ceramic Capacitor:CC0805KKX7R7BB105; COPYRIGHT: Copyright C 2015 Accelerated Designs. All rights reserved; MANUFACTURER_PART_NUMBER: CC0805KKX7R7BB105; VENDOR: Vendor
C4 C8 C11 C17 C26 C28 C33 C34 = 10uF X5R Ceramic Capacitor:GRM21BR60J106ME19L; COPYRIGHT: Copyright C 2015 Accelerated Designs. All rights reserved; MANUFACTURER_PART_NUMBER: GRM21BR60J106ME19L; VENDOR: Vendor
C5 C16 C30 C32 = 22uF X5R Ceramic Capacitor:GRM21BR60J226ME39L; COPYRIGHT: Copyright C 2015 Accelerated Designs. All rights reserved; MANUFACTURER_PART_NUMBER: GRM21BR60J226ME39L; VENDOR: Vendor
C6 C7 C12-C15 = thanics_robotics:10NF_CAPACITOR
C18 C20 = 560pF-capacitor:CC0402KRX7R9BB561; MANUFACTURER_PART_NUMBER: CC0402KRX7R9BB561; VENDOR: Yageo
C19 = 2.2uF X5R Capacitor:GRM188R61C225KE15J; COPYRIGHT: Copyright C 2015 Accelerated Designs. All rights reserved; MANUFACTURER_PART_NUMBER: GRM188R61C225KE15J; VENDOR: Vendor
C37 C38 = 16pF-capacitor:GRM1555C1H160JA01D; MANUFACTURER_PART_NUMBER: GRM1555C1H160JA01D; VENDOR: Murata
D1-D4 = SparkFun-LED:LED-GREEN: Green SMD LED Used in manufacturing of various products at SparkFun Packages: 0603 - SMD 0603 package [Product Link] <http://www.futureelectronics.com/en/technologies/semiconductors/optoelectronics/leds/Pages/9894312-LTST-C190GKT.aspx?CrossPart=HSMG-C190&IM=0> LilyPad 1206 - SMD1206 LilyPad package [Product Link] <http://www.futureelectronics.com/en/Technologies/Product.aspx?ProductID=IN150NGHARVATEKCORPORATION2049943&IM=0> 1206 - SMD1206 package [Product Link] <http://www.futureelectronics.com/en/technologies/semiconductors/optoelectronics/leds/Pages/8315665-LTST-C150KGKT.aspx?IM=0> 1206 Bottom Mount -SMD 1206 Bottom Mount [Product Link] <http://www.digikey.com/product-detail/en/lite-on-inc/LTST-C230KGKT/160-1456-1-ND/386854> SparkFun Products: Pro Mini 328 -5V <https://www.sparkfun.com/products/821> RedBoard <https://www.sparkfun.com/products/12757> MP3 Trigger <https://www.sparkfun.com/products/13720> Makey Makey <https://www.sparkfun.com/products/11076>; PROD_ID: DIO-00821
IC1 = raspberrypi_cm:FSUSB42: FSUSB42 www.hasseb.fi
J1 J2 = thanics_robotics:JOYSTICK
J3 J5 = thanics_robotics:USB_MICRO_B_SMT
J4 = thanics_robotics:2_PIN_CONNECTOR
J6 = thanics_robotics:POWER_CONNECTOR
J7 = raspberrypi_cm:HDMI
JP1 = pinhead:PINHD-1X2: PIN HEADER
JP2 = adafruit:PINHD-1X3: PIN HEADER
L1 L4 = 4.7uH-inductor:IFSC1515AHER4R7M01; MANUFACTURER_PART_NUMBER: IFSC1515AHER4R7M01; VENDOR: VISHAY
L2 L3 = thanics_robotics:470NH_INDUCTOR
R1 = thanics_robotics:100_RESISTOR
R2 R4 R5 R8 R9 R14-R16 R21-R29 R35 R37 R38 R40-R45 = 10k-resistor:ERA-6AEB103V; CASE: 0805 2012 metric; COMPOSITION: Thin Film; COPYRIGHT: Copyright C 2015 Accelerated Designs. All rights reserved; DATASHEET: httpindustrial.panasonic.comwwwcgijvcr13pz.cgi?E+PZ+3+AOA0026+ERA6AEB103V+7+WW; DIGIKEYPARTNUMBER: P10KDATRND; HEIGHT: 0.024" 0.60mm; LEADSTYLE: Surface Mount SMD SMT; MANUFACTURER_PART_NUMBER: ERA6AEB103V; NUMBEROFTERMINATIONS: 2; PACKAGECASE: 0805 2012 Metric; PACKAGING: Tape &amp Reel TR; POWERWATTS: 0.125W 18W; QUANTITY_AVAILABLE: 225000; RESISTANCEINOHMS: 10.0K; RESISTANCEOHMS: 10K; SIZEDIMENSION: 0.079" L x 0.049" W 2.00mm x 1.25mm; TEMPERATURECOEFFICIENT: 25ppm°C; TOLERANCE: 0.1%; VENDOR: Panasonic; VOLTAGEWORKING: 100V
R3 R10 R36 R39 = 100k-resistor:RC0603JR-07100KL; MANUFACTURER_PART_NUMBER: RC0603JR07100KL; VENDOR: Yageo
R6 R7 R12 R13 R34 = 1k-resistor:RC0603JR-071KL; CASE: 0603 1608 metric; COMPOSITION: Thick Film; COPYRIGHT: Copyright C 2015 Accelerated Designs. All rights reserved; DATASHEET: httpwww.yageo.comdocumentsrecentPYuRC0603_51_RoHS_L_4.pdf; DESCRIPTION: RES 1.0K OHM 110W 5% 0603 SMD; DIGIKEYPARTNUMBER: 3111.0KGRTRND; HEIGHT: 0.022" 0.55mm; LEADSTYLE: Surface Mount SMD SMT; MANUFACTURER_PART_NUMBER: RC0603JR071KL; NEWARKPARTNUMBER: 14M7231; NUMBEROFTERMINATIONS: 2; PACKAGECASE: 0603 1608 Metric; PACKAGING: Tape &amp Reel TR; POWERWATTS: 0.1W 110W; QUANTITY_AVAILABLE: 0; RESISTANCEINOHMS: 1.00K; RESISTANCEOHMS: 1K; SIZEDIMENSION: 0.063" L x 0.031" W 1.60mm x 0.80mm; TEMPERATURECOEFFICIENT: 100ppm°C; TOLERANCE: 5%; VENDOR: Yageo; VOLTAGEWORKING: 50V
R11 = 1M-resistor:RC0603JR-071ML; MANUFACTURER_PART_NUMBER: RC0603JR071ML; VENDOR: Yageo
R17 R32 = 20-resistor:RC0603JR-0720RL; MANUFACTURER_PART_NUMBER: RC0603JR0720RL; VENDOR: Yageo
R18 R33 = 340-resistor:RC0603FR-07340RL; CASE: 0603 1608 metric; COMPOSITION: Thick Film; COPYRIGHT: Copyright C 2015 Accelerated Designs. All rights reserved; DATASHEET: httpwww.yageo.comdocumentsrecentPYuRC0603_51_RoHS_L_4.pdf; DIGIKEYPARTNUMBER: 311340HRTRND; HEIGHT: 0.022" 0.55mm; LEADSTYLE: Surface Mount SMD SMT; MANUFACTURER_PART_NUMBER: RC0603FR07340RL; NEWARKPARTNUMBER: 66R2325; NUMBEROFTERMINATIONS: 2; PACKAGECASE: 0603 1608 Metric; PACKAGING: Tape &amp Reel TR; POWERWATTS: 0.1W 110W; QUANTITY_AVAILABLE: 95000; RESISTANCEINOHMS: 340; RESISTANCEOHMS: 340; SIZEDIMENSION: 0.063" L x 0.031" W 1.60mm x 0.80mm; TEMPERATURECOEFFICIENT: 100ppm°C; TOLERANCE: 1%; VENDOR: Yageo; VOLTAGEWORKING: 50V
R19 R20 = 24.9k-resistor:RC0402FR-0724K9L; MANUFACTURER_PART_NUMBER: RC0402FR0724K9L; VENDOR: Yageo
R30 = 160k-resistor:RC0603FR-07160KL; MANUFACTURER_PART_NUMBER: RC0603FR07160KL; VENDOR: Yageo
R31 = 499k-resistor:RC0603FR-07499KL; MANUFACTURER_PART_NUMBER: RC0603FR07499KL; VENDOR: Yageo
TP1 = testpad:TPSQ: Test pad
U1 = thanics_robotics:AAT3620_BATT_CHARGER
U2 = 8ch ADC:MAX11608EEE+; COPYRIGHT: Copyright C 2015 Accelerated Designs. All rights reserved; DATAINTERFACE: I²C Serial; DATASHEET: httpdatasheets.maximic.comendsMAX11606MAX11611.pdf; DESCRIPTION: IC ADC SERIAL 10BIT 8CH 16QSOP; DIGIKEYPARTNUMBER: MAX11608EEE+ND; MANUFACTURER_PART_NUMBER: MAX11608EEE+; MOUNTINGTYPE: Surface Mount; NUMBEROFBITS: 10; NUMBEROFCONVERTERS: 1; NUMBEROFINPUTSANDTYPE: 8 SingleEnded Unipolar 8 SingleEnded Bipolar 4 Differential Unipolar 4 Differential Bipolar; OPERATINGTEMPERATURE: 40°C ~ 85°C; PACKAGECASE: 16SSOP 0.154" 3.90mm Width; PACKAGING: Tube; POWERDISSIPATIONMAX: 666.7mW; QUANTITY_AVAILABLE: 814; SAMPLINGRATEPERSECOND: 94.4k; SUPPLIERDEVICEPACKAGE: 16QSOP; VENDOR: Maxim Integrated Products; VOLTAGESUPPLYSOURCE: Single Supply
U3 = tps61256-5vreg:TPS61256YFFR; MANUFACTURER_PART_NUMBER: TPS61256YFFR; VENDOR: Texas Instruments
U4 = thanics_robotics:DMP3030SN_MOSFET
U5 = thanics_robotics:NPN_BCW65CLT1G
U6 = raspberrypi_cm:COMPUTE_MODULE: Raspberry Pi Compute Module www.hasseb.fi
U$1 = LM3880MF:LM3880MF-1AA/NOPB; MANUFACTURER_PART_NUMBER: lm3880mf1aaNOPB; VENDOR: National Semiconductor
U$2 = thanics_robotics:APPLE_2.0C_COPROCESSOR
U$3 = thanics_robotics:4_PIN_TELE_CONNECTOR
U$4 = thanics_robotics:MIC23050
U$5 = thanics_robotics:TPS6209
U$9 U$10 = thanics_robotics:PEC12R
U$11 = thanics_robotics:USB_A_RECEPT
U$12 = thanics_robotics:3.5_TOUCHSCREEN
U$13 = mcp6001t-opamp:MCP6001T-I/OT; MANUFACTURER_PART_NUMBER: MCP6001TIOT; VENDOR: Microchip
U$14 = thanics_robotics:SPH1642HT5H-1
U$15 = thanics_robotics:SP-1510
U$16 = TLV320DAC-amp:TLV320DAC3120IRHBR; MANUFACTURER_PART_NUMBER: tlv320dac3120_rhb_32; VENDOR: Texas Instruments
U$18 U$20 U$21 U$23 = thanics_robotics:DMG1012T
U$19 = thanics_robotics:ESD5384
U$24 = thanics_robotics:USB2512B
U$25 = thanics_robotics:AGND-DGND
X1 = thanics_robotics:FA-128-24MHZ
X2 = adafruit:ESP-12